# Altium schematic sheet general OpAmp.SchDoc
size A3
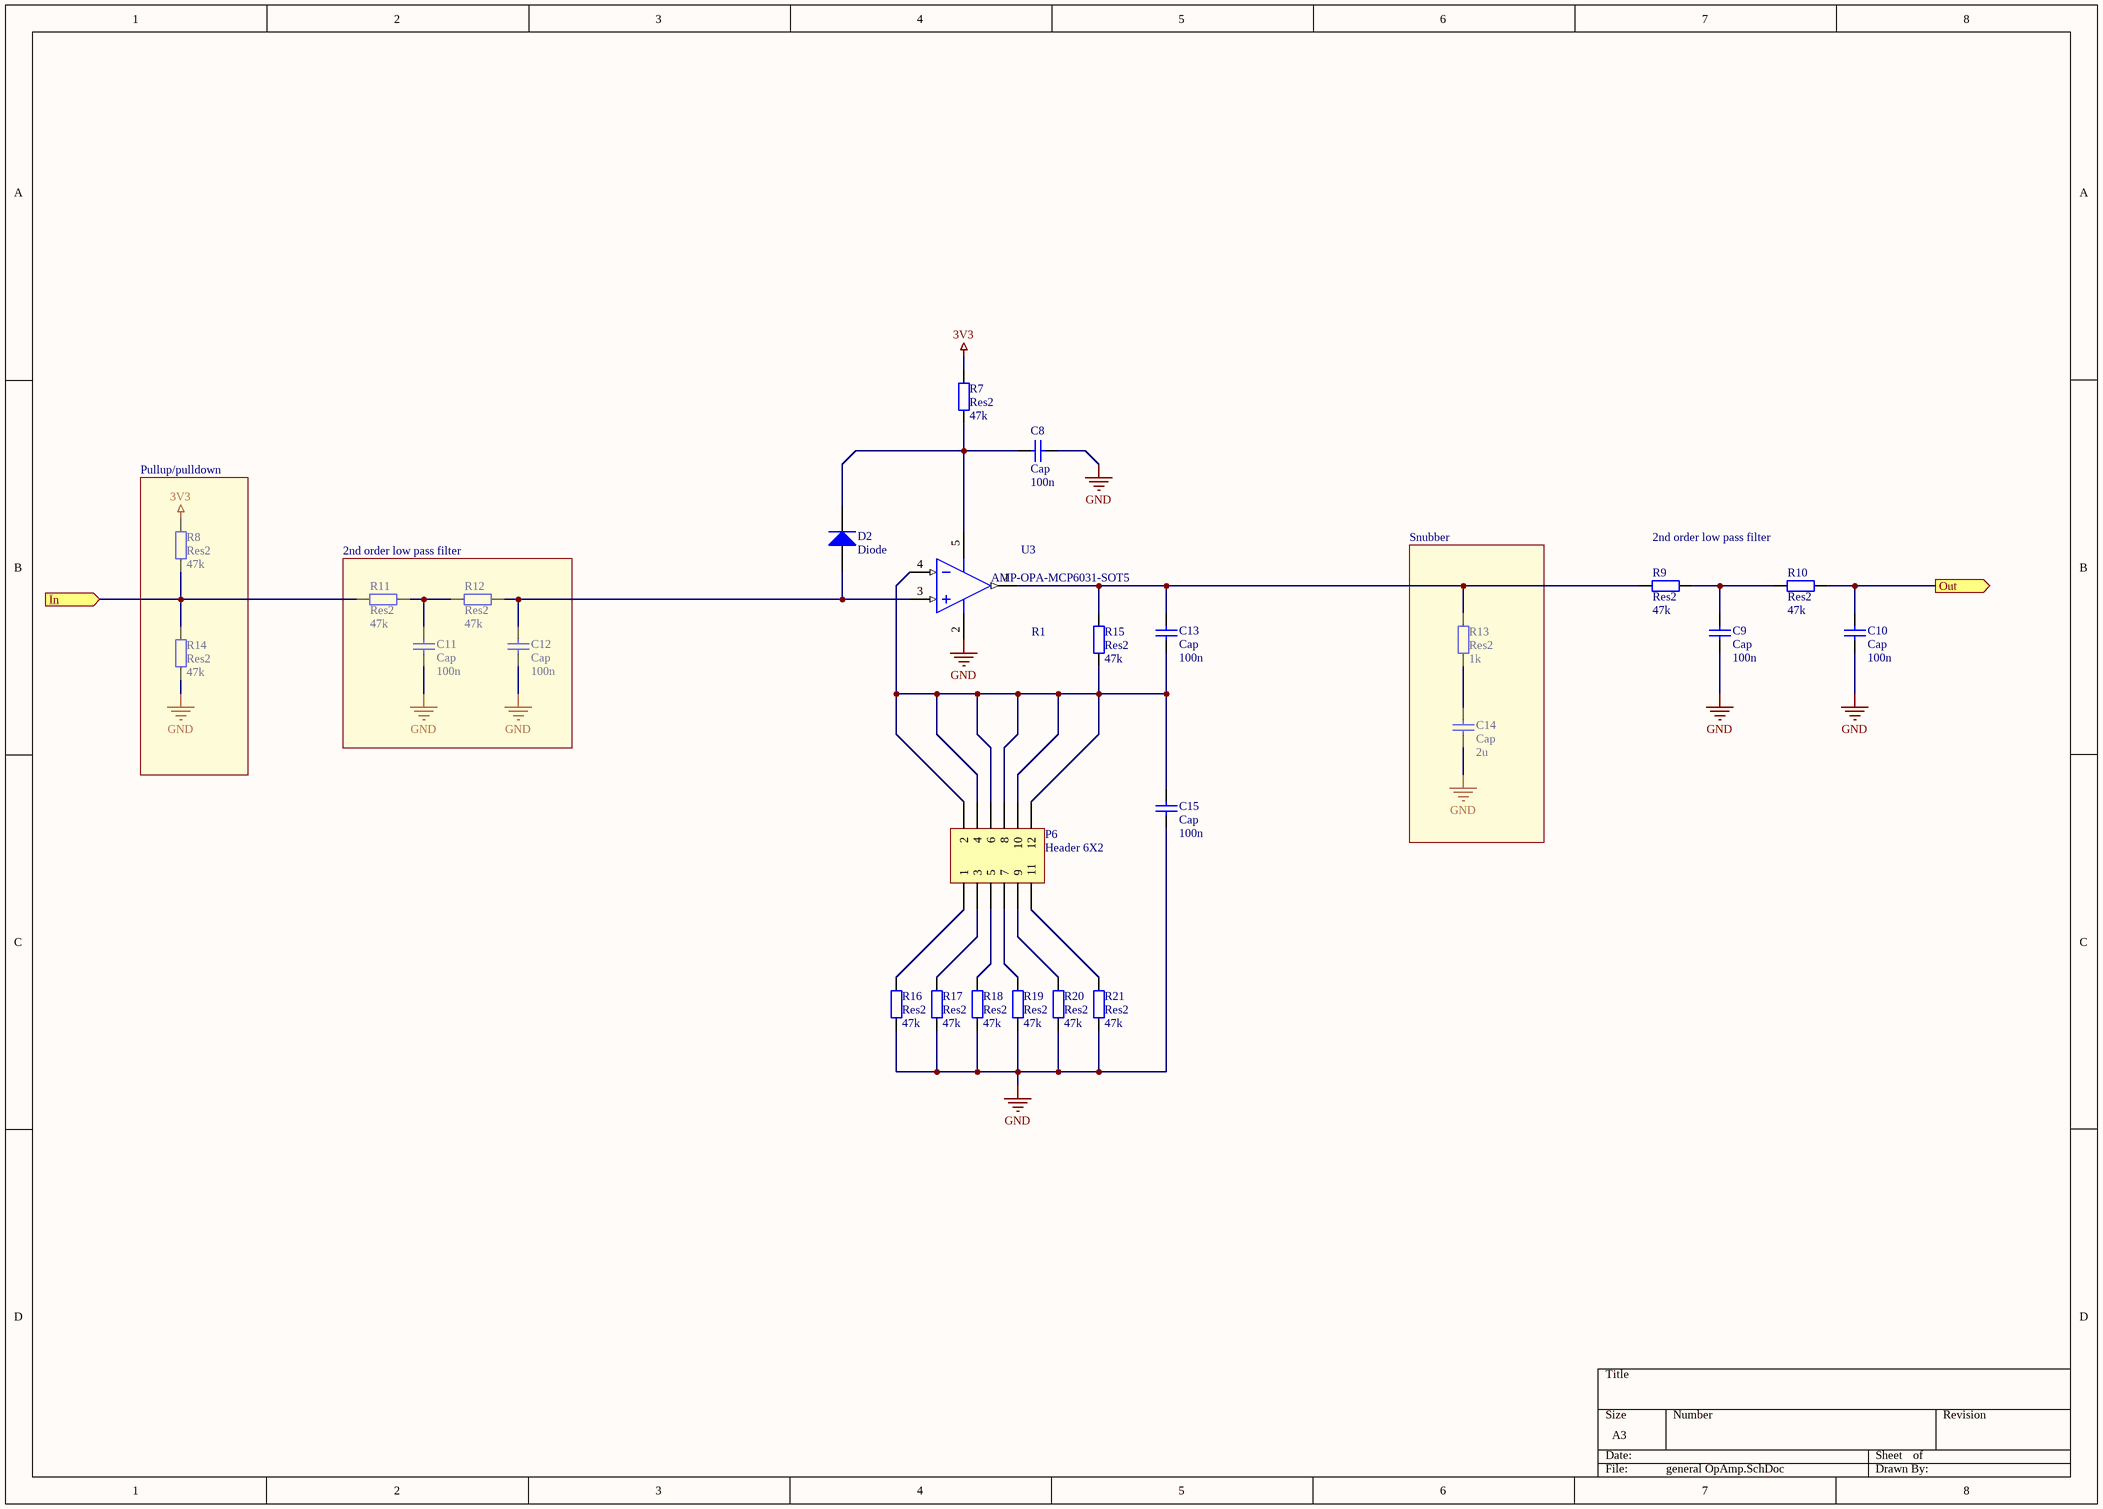
[diagram p0: general OpAmp.SchDoc]

## Parts
C8  Cap  value 100n  [SMD_Resistor_1206]
C9  Cap  value 100n  [SMD_Resistor_1206]
C10  Cap  value 100n  [SMD_Resistor_1206]
C11  Cap  value 100n  [SMD_Resistor_1206]
C12  Cap  value 100n  [SMD_Resistor_1206]
C13  Cap  value 100n  [SMD_Resistor_1206]
C14  Cap  value 2u  [SMD_Resistor_1206]
C15  Cap  value 100n  [SMD_Resistor_1206]
D2  Diode  [SMD_Resistor_1206]
P6  Header 6X2  [HDR2X6]
R7  Res2  value 47k  [SMD_Resistor_1206]
R8  Res2  value 47k  [SMD_Resistor_1206]
R9  Res2  value 47k  [SMD_Resistor_1206]
R10  Res2  value 47k  [SMD_Resistor_1206]
R11  Res2  value 47k  [SMD_Resistor_1206]
R12  Res2  value 47k  [SMD_Resistor_1206]
R13  Res2  value 1k  [SMD_Resistor_1206]
R14  Res2  value 47k  [SMD_Resistor_1206]
R15  Res2  value 47k  [SMD_Resistor_1206]
R16  Res2  value 47k  [SMD_Resistor_1206]
R17  Res2  value 47k  [SMD_Resistor_1206]
R18  Res2  value 47k  [SMD_Resistor_1206]
R19  Res2  value 47k  [SMD_Resistor_1206]
R20  Res2  value 47k  [SMD_Resistor_1206]
R21  Res2  value 47k  [SMD_Resistor_1206]
U3  AMP-OPA-MCP6031-SOT5  [SOT-23-OT5_M]

## Blocks framed on the sheet
Pullup/pulldown: R8 R14
2nd order low pass filter: C11 C12 R11 R12
Snubber: C14 R13

## Ports
In (in), Out (out)

## Nets
3V3: R7.1 R8.1
GND: C8.2 C9.1 C10.1 C11.1 C12.1 C14.1 C15.1 R14.2 R16.1 R17.1 R18.1 R19.1 R20.1 R21.1 U3.2(VSS)
In: R8.2 R11.1 R14.1 ; port In
Out: C10.2 R10.2 ; port Out
NetC8_1: C8.1 D2.2(K) R7.2 U3.5(VDD)
NetC9_2: C9.2 R9.2 R10.1
NetC11_2: C11.2 R11.2 R12.1
NetC12_2: C12.2 D2.1(A) R12.2 U3.3(VIN+)
NetC13_1: C13.1 C15.2 P6.2 P6.4 P6.6 P6.8 P6.10 P6.12 R15.1 U3.4(VIN-)
NetC13_2: C13.2 R9.1 R13.2 R15.2 U3.1(VOUT)
NetC14_2: C14.2 R13.1
NetP6_1: P6.1 R16.2
NetP6_3: P6.3 R17.2
NetP6_5: P6.5 R18.2
NetP6_7: P6.7 R19.2
NetP6_9: P6.9 R20.2
NetP6_11: P6.11 R21.2

## Notes on the sheet
- 2nd order low pass filter
- R1

## Library data of the parts
C8-C15 = Cap: Capacitor; Published: 8-Jun-2000; LatestRevisionDate: 17-Jul-2002; LatestRevisionNote: Re-released for DXP Platform.; PackageReference: RAD-0.3; Publisher: Altium Limited; PackageDescription: Radial Cap, Thru-Hole; 2 Leads; 0.3 in Pin Spacing
D2 = Diode: Default Diode; Published: 8-Jun-2000; LatestRevisionDate: 17-Jul-2002; LatestRevisionNote: Re-released for DXP Platform.; PackageVersion: Sep-1996; PackageReference: SMC; Publisher: Altium Limited; PackageDescription: DO-214-AB/SMC; 2 C-Bend Leads; Body 7.9 x 5.9 mm, inc. leads (LxW); Code_JEDEC: DO-214-AB
P6 = Header 6X2: Header, 6-Pin, Dual row; LatestRevisionDate: 17-Jul-2002; LatestRevisionNote: Re-released for DXP Platform.; Publisher: Altium Limited
R7-R21 = Res2: Resistor; Published: 8-Jun-2000; LatestRevisionDate: 17-Jul-2002; LatestRevisionNote: Re-released for DXP Platform.; PackageReference: AXIAL-0.4; Publisher: Altium Limited; PackageDescription: Axial Device, Thru-Hole; 2 Leads; 0.4 in Pin Spacing